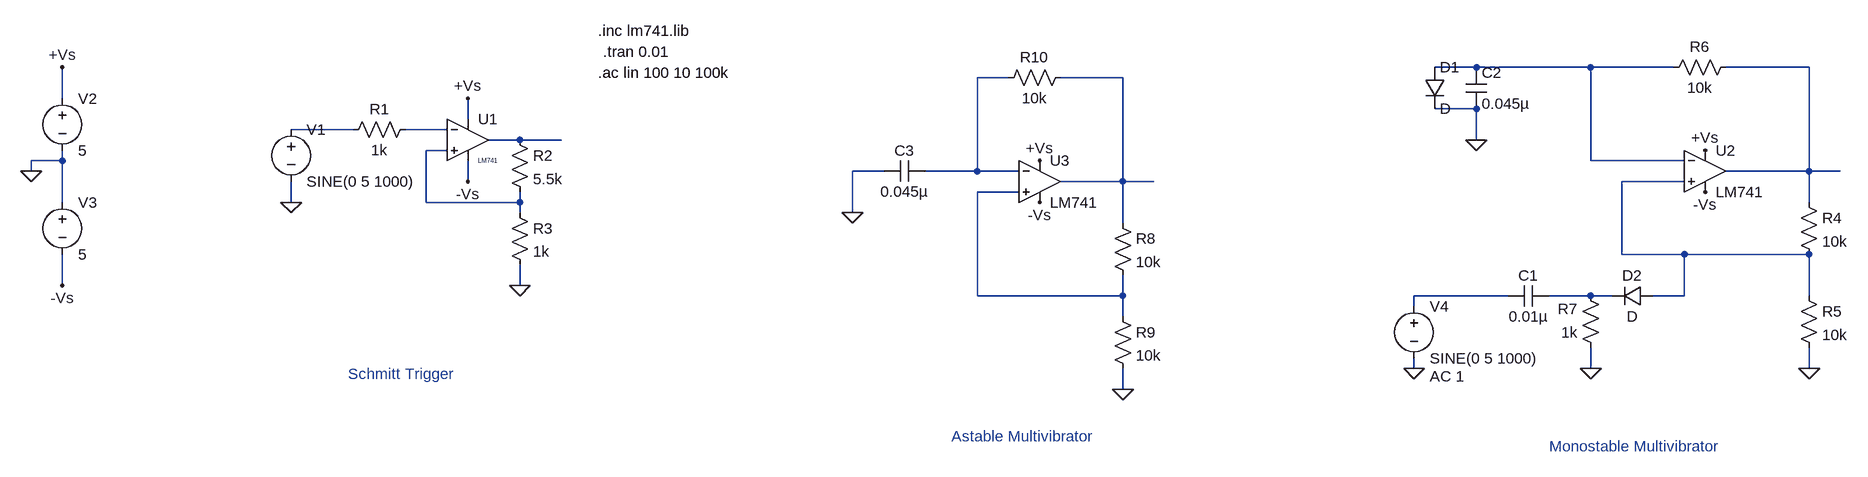
[diagram p0: schematic op-amp oscillator.asc]
op-amp oscillator.asc, the LTspice schematic file:
Version 4
SHEET 1 2020 680
WIRE 1440 16 1376 16
WIRE 1616 16 1440 16
WIRE 1744 16 1616 16
WIRE 1952 16 1824 16
WIRE 720 32 672 32
WIRE 896 32 800 32
WIRE -736 64 -736 16
WIRE 1440 80 1376 80
WIRE -112 96 -112 64
WIRE -288 112 -384 112
WIRE -144 112 -208 112
WIRE -32 128 -80 128
WIRE 32 128 -32 128
WIRE 1440 128 1440 80
WIRE -144 144 -176 144
WIRE -736 160 -736 144
WIRE -736 160 -784 160
WIRE 1616 160 1616 16
WIRE 1760 160 1616 160
WIRE -784 176 -784 160
WIRE 528 176 480 176
WIRE 672 176 672 32
WIRE 672 176 592 176
WIRE 736 176 672 176
WIRE 1952 176 1952 16
WIRE 1952 176 1824 176
WIRE 2000 176 1952 176
WIRE -112 192 -112 160
WIRE 896 192 896 32
WIRE 896 192 800 192
WIRE 944 192 896 192
WIRE 1760 192 1664 192
WIRE 736 208 672 208
WIRE -736 224 -736 160
WIRE -384 224 -384 192
WIRE -176 224 -176 144
WIRE -32 224 -32 208
WIRE -32 224 -176 224
WIRE 1952 224 1952 176
WIRE -32 240 -32 224
WIRE 480 240 480 176
WIRE 896 256 896 192
WIRE 1664 304 1664 192
WIRE 1760 304 1664 304
WIRE 1952 304 1760 304
WIRE -736 352 -736 304
WIRE -32 352 -32 320
WIRE 672 368 672 208
WIRE 896 368 896 336
WIRE 896 368 672 368
WIRE 1488 368 1344 368
WIRE 1616 368 1552 368
WIRE 1648 368 1616 368
WIRE 1760 368 1760 304
WIRE 1760 368 1712 368
WIRE 1952 368 1952 304
WIRE 1344 384 1344 368
WIRE 896 400 896 368
WIRE 1344 480 1344 464
WIRE 1616 480 1616 448
WIRE 1952 480 1952 448
WIRE 896 512 896 480
FLAG -32 352 0
FLAG -384 224 0
FLAG -784 176 0
FLAG 1616 480 0
FLAG 1344 480 0
FLAG 1440 128 0
FLAG 1952 480 0
FLAG 896 512 0
FLAG 480 240 0
FLAG -736 16 +Vs
FLAG -112 64 +Vs
FLAG 768 160 +Vs
FLAG 1792 144 +Vs
FLAG -736 352 -Vs
FLAG -112 192 -Vs
FLAG 768 224 -Vs
FLAG 1792 208 -Vs
SYMBOL OpAmps\\opamp2 -112 64 R0
WINDOW 3 16 96 Left 0
SYMATTR Value LM741
SYMATTR InstName U1
SYMBOL res -192 96 R90
WINDOW 0 0 56 VBottom 2
WINDOW 3 32 56 VTop 2
SYMATTR InstName R1
SYMATTR Value 1k
SYMBOL res -48 112 R0
SYMATTR InstName R2
SYMATTR Value 5.5k
SYMBOL res -48 224 R0
SYMATTR InstName R3
SYMATTR Value 1k
SYMBOL voltage -384 96 R0
WINDOW 123 0 0 Left 0
WINDOW 39 0 0 Left 0
SYMATTR InstName V1
SYMATTR Value SINE(0 5 1000)
SYMBOL voltage -736 48 R0
WINDOW 123 0 0 Left 0
WINDOW 39 0 0 Left 0
SYMATTR InstName V2
SYMATTR Value 5
SYMBOL voltage -736 208 R0
WINDOW 123 0 0 Left 0
WINDOW 39 0 0 Left 0
SYMATTR InstName V3
SYMATTR Value 5
SYMBOL OpAmps\\opamp2 1792 112 R0
SYMATTR InstName U2
SYMATTR Value LM741
SYMBOL res 1936 208 R0
SYMATTR InstName R4
SYMATTR Value 10k
SYMBOL res 1936 352 R0
SYMATTR InstName R5
SYMATTR Value 10k
SYMBOL res 1840 0 R90
WINDOW 0 0 56 VBottom 2
WINDOW 3 32 56 VTop 2
SYMATTR InstName R6
SYMATTR Value 10k
SYMBOL res 1632 464 R180
WINDOW 0 36 76 Left 2
WINDOW 3 36 40 Left 2
SYMATTR InstName R7
SYMATTR Value 1k
SYMBOL cap 1552 352 R90
WINDOW 0 0 32 VBottom 2
WINDOW 3 32 32 VTop 2
SYMATTR InstName C1
SYMATTR Value 0.01µ
SYMBOL cap 1424 16 R0
SYMATTR InstName C2
SYMATTR Value 0.045µ
SYMBOL diode 1360 16 R0
SYMATTR InstName D1
SYMBOL diode 1712 352 R90
WINDOW 0 0 32 VBottom 2
WINDOW 3 32 32 VTop 2
SYMATTR InstName D2
SYMBOL voltage 1344 368 R0
WINDOW 123 24 124 Left 2
WINDOW 39 0 0 Left 0
SYMATTR Value2 AC 1
SYMATTR InstName V4
SYMATTR Value SINE(0 5 1000)
SYMBOL OpAmps\\opamp2 768 128 R0
SYMATTR InstName U3
SYMATTR Value LM741
SYMBOL res 880 240 R0
SYMATTR InstName R8
SYMATTR Value 10k
SYMBOL res 880 384 R0
SYMATTR InstName R9
SYMATTR Value 10k
SYMBOL res 816 16 R90
WINDOW 0 0 56 VBottom 2
WINDOW 3 32 56 VTop 2
SYMATTR InstName R10
SYMATTR Value 10k
SYMBOL cap 592 160 R90
WINDOW 0 0 32 VBottom 2
WINDOW 3 32 32 VTop 2
SYMATTR InstName C3
SYMATTR Value 0.045µ
TEXT 88 -40 Left 2 !.inc lm741.lib
TEXT 96 -8 Left 2 !.tran 0.01
TEXT 88 24 Left 2 !.ac lin 100 10 100k
TEXT -296 488 Left 2 ;Schmitt Trigger
TEXT 632 584 Left 2 ;Astable Multivibrator
TEXT 1552 600 Left 2 ;Monostable Multivibrator

The netlist it stands for:
* op-amp oscillator.asc
XU1 N008 N006 +Vs -Vs N007 LM741  ; pins In+ In- V+ V- OUT
R1 N006 N005 1k
R2 N007 N008 5.5k
R3 N008 0 1k
V1 N005 0 SINE(0 5 1000)
V2 +Vs 0 5
V3 0 -Vs 5
XU2 N009 N001 +Vs -Vs N002 LM741  ; pins In+ In- V+ V- OUT
R4 N002 N009 10k
R5 N009 0 10k
R6 N002 N001 10k
R7 0 N012 1k
C1 N012 N011 0.01µ
C2 N001 0 0.045µ
D1 N001 0 D
D2 N009 N012 D
V4 N011 0 SINE(0 5 1000) AC 1
XU3 N010 N003 +Vs -Vs N004 LM741  ; pins In+ In- V+ V- OUT
R8 N004 N010 10k
R9 N010 0 10k
R10 N004 N003 10k
C3 N003 0 0.045µ
.model D D
.lib standard.dio
.inc lm741.lib
.tran 0.01
.ac lin 100 10 100k
* Schmitt Trigger
* Astable Multivibrator
* Monostable Multivibrator
.backanno
.end